# EAGLE design E32_Roco_43917_PLUX22_J1_019_01_06 (EAGLE 5.10)
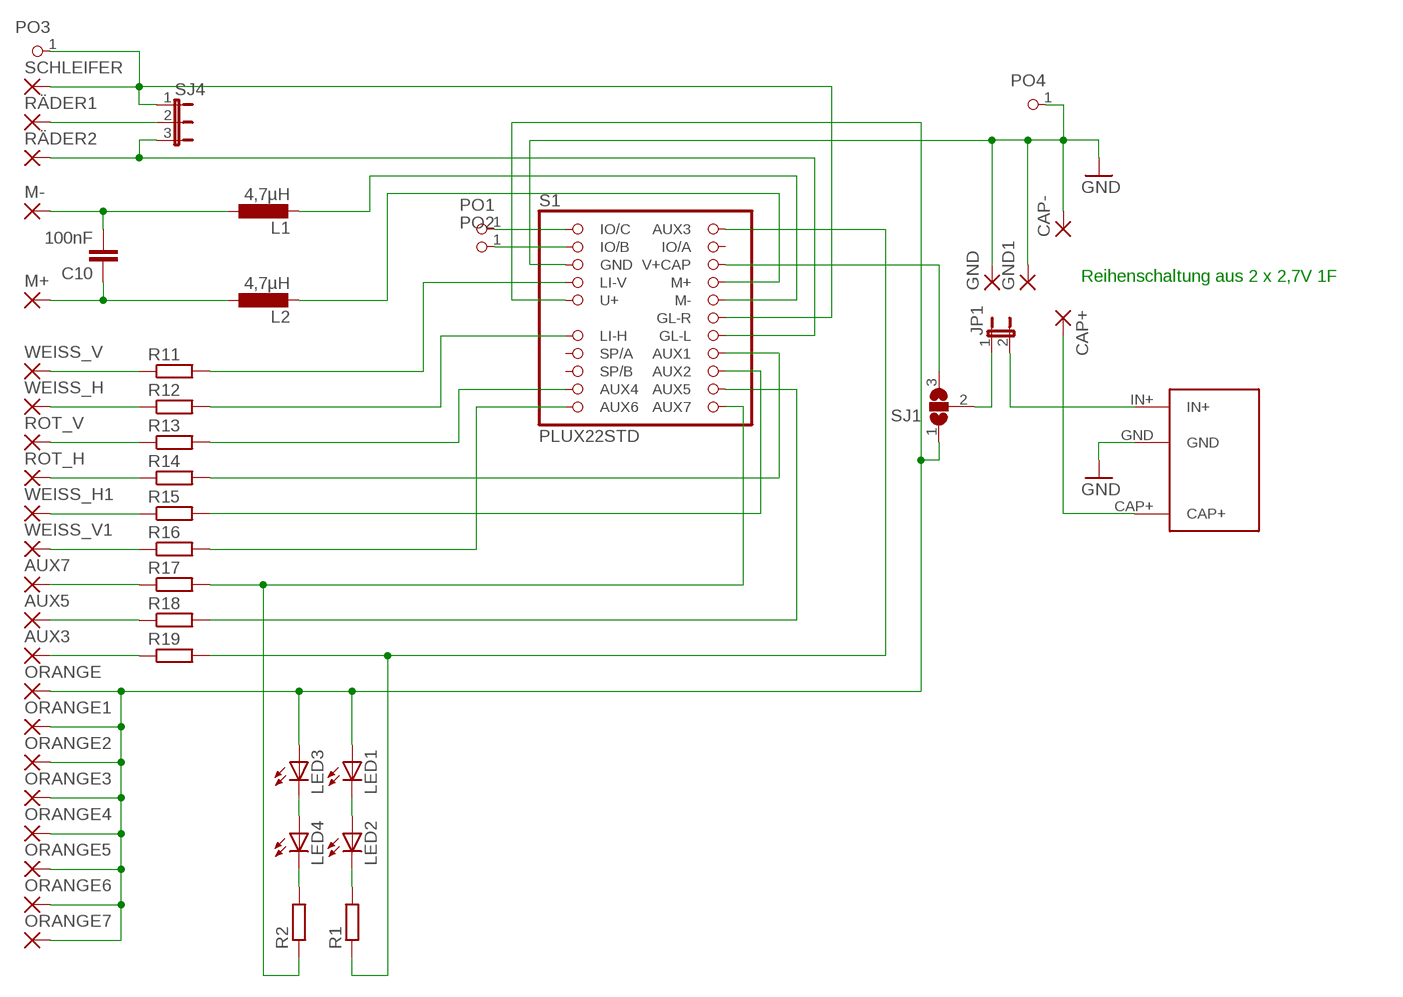
[diagram p0: schematic, sheet 1]

## Parts
AUX3  SMD2  [SMD1,27-2,54]
AUX5  SMD2  [SMD1,27-2,54]
AUX7  SMD2  [SMD1,27-2,54]
C10  100nF  C-EUC0603  [C0603]
CAP+  1,6/0,8  [1,6/0,8]
CAP-  1,6/0,8  [1,6/0,8]
GND  SMD2  [SMD1,27-2,54]
GND1  SMD2  [SMD1,27-2,54]
JP1  JP1E2,00R  [JP1_2R]
L1  4,7µH  L-EUL1212  [L1212]
L2  4,7µH  L-EUL1212  [L1212]
LED1  LEDCHIPLED_0603-JP  [CHIPLED-0603-JP]
LED2  LEDCHIPLED_0603-JP  [CHIPLED-0603-JP]
LED3  LEDCHIPLED_0603-JP  [CHIPLED-0603-JP]
LED4  LEDCHIPLED_0603-JP  [CHIPLED-0603-JP]
M+  SMD-LONG1,27-2,54  [SMD1,27-2,54]
M-  SMD-LONG1,27-2,54  [SMD1,27-2,54]
ORANGE  SMD2  [SMD1,27-2,54]
ORANGE1  SMD2  [SMD1,27-2,54]
ORANGE2  SMD2  [SMD1,27-2,54]
ORANGE3  SMD2  [SMD1,27-2,54]
ORANGE4  SMD2  [SMD1,27-2,54]
ORANGE5  SMD2  [SMD1,27-2,54]
ORANGE6  SMD2  [SMD1,27-2,54]
ORANGE7  SMD2  [SMD1,27-2,54]
PO1  POGO2,6MM  [POGO2.6]
PO2  POGO2,6MM  [POGO2.6]
PO3  POGO2,6MM  [POGO2.6]
PO4  POGO2,6MM  [POGO2.6]
R1  R-EU_R0603  [R0603]
R2  R-EU_R0603  [R0603]
R11  R-EU_R0603S  [R0603S]
R12  R-EU_R0603S  [R0603S]
R13  R-EU_R0603S  [R0603S]
R14  R-EU_R0603S  [R0603S]
R15  R-EU_R0603S  [R0603S]
R16  R-EU_R0603S  [R0603S]
R17  R-EU_R0603S  [R0603S]
R18  R-EU_R0603S  [R0603S]
R19  R-EU_R0603S  [R0603S]
ROT_H  SMD2  [SMD1,27-2,54]
ROT_V  SMD2  [SMD1,27-2,54]
RÄDER1  SMD2  [SMD1,27-2,54]
RÄDER2  SMD2  [SMD1,27-2,54]
S1  PLUX22STD  [PLUX22_SMD]
SCHLEIFER  SMD2  [SMD1,27-2,54]
SJ1  SJ2SS  [SJ_2SS]
SJ4  JP2E2R  [JP2_2R]
U$2  PWR_CAPT  [POWER_CAP]
WEISS_H  SMD2  [SMD1,27-2,54]
WEISS_H1  SMD2  [SMD1,27-2,54]
WEISS_V  SMD2  [SMD1,27-2,54]
WEISS_V1  SMD2  [SMD1,27-2,54]

## Nets
AUX1: R14.2 S1.P16(AUX1)
AUX2: R15.2 S1.P18(AUX2)
AUX4: R13.2 S1.P19(AUX4)
AUX5: R18.2 S1.P20(AUX5)
AUX6: R16.2 S1.P21(AUX6)
AUX7: R2.1 R17.2 S1.P22(AUX7)
BLAU: C10.1 L2.1 M+.1(P)
CAP: CAP+.1(P) U$2.CAP+
GELB: R12.2 S1.P13(LI-H)
GND: CAP-.1(P) GND1.1(P) GND.1(P) PO4.1 S1.P5(GND) U$2.GND
GRAU: R11.2 S1.P7(LI-V)
GRÜN: C10.2 L1.1 M-.1(P)
IN: JP1.2 U$2.IN+
IO/B: PO2.1 S1.P3(IO/B)
IO/C: PO1.1 S1.P1(IO/C)
N$1: R1.1 R19.2 S1.P2(AUX3)
N$2: LED1.C LED2.A
N$3: AUX7.1(P) R17.1
N$4: AUX5.1(P) R18.1
N$5: AUX3.1(P) R19.1
N$6: LED3.C LED4.A
N$7: JP1.1 SJ1.2
N$8: R13.1 ROT_V.1(P)
N$9: R14.1 ROT_H.1(P)
N$10: R12.1 WEISS_H.1(P)
N$11: R11.1 WEISS_V.1(P)
N$12: S1.P6(V+CAP) SJ1.3
N$13: LED2.C R1.2
N$14: LED4.C R2.2
N$20: R15.1 WEISS_H1.1(P)
N$21: R16.1 WEISS_V1.1(P)
N$22: L2.2 S1.P8(M+)
N$23: L1.2 S1.P10(M-)
ORANGE: LED1.A LED3.A ORANGE1.1(P) ORANGE2.1(P) ORANGE3.1(P) ORANGE4.1(P) ORANGE5.1(P) ORANGE6.1(P) ORANGE7.1(P) ORANGE.1(P) S1.P9(U+) SJ1.1
RÄDER: RÄDER2.1(P) S1.P14(GL-L) SJ4.3
RÄDER2: RÄDER1.1(P) SJ4.2
SCHLEIFER: PO3.1 S1.P12(GL-R) SCHLEIFER.1(P) SJ4.1
Unconnected: S1.P4(IO/A) S1.P15(SP/A) S1.P17(SP/B)

## Notes on the sheet
- Reihenschaltung aus 2 x 2,7V 1F

## Library data of the parts
AUX3 AUX5 AUX7 GND GND1 ORANGE ORANGE1-ORANGE7 ROT_H ROT_V RÄDER1 RÄDER2 SCHLEIFER WEISS_H WEISS_H1 WEISS_V WEISS_V1 = wirepad:SMD2: SMD PAD
C10 = rcl:C-EU: CAPACITOR, European symbol
CAP+ CAP- = wirepad:1,6/0,8: THROUGH-HOLE PAD
JP1 = jumper:JP1E: JUMPER
L1 L2 = rcl:L-EU: INDUCTOR, European symbol
LED1-LED4 = led:LED: LED OSRAM: - CHIPLED LG R971, LG N971, LY N971, LG Q971, LY Q971, LO R971, LY R971 LH N974, LH R974 LS Q976, LO Q976, LY Q976 LO Q996 - Hyper CHIPLED LW Q18S LB Q993, LB Q99A, LB R99A - SideLED LS A670, LO A670, LY A670, LG A670, LP A670 LB A673, LV A673, LT A673, LW A673 LH A674 LY A675 LS A676, LA A676, LO A676, LY A676, LW A676 LS A679, LY A679, LG A679 - Hyper Micro SIDELED® LS Y876, LA Y876, LO Y876, LY Y876 LT Y87S - SmartLED LW L88C, LW L88S LB L89C, LB L89S, LG L890 LS L89K, LO L89K, LY L89K LS L896, LA L896, LO L896, LY L896 - TOPLED LS T670, LO T670, LY T670, LG T670, LP T670 LSG T670, LSP T670, LSY T670, LOP T670, LYG T670 LG T671, LOG T671, LSG T671 LB T673, LV T673, LT T673, LW T673 LH T674 LS T676, LA T676, LO T676, LY T676, LB T676, LH T676, LSB T676, LW T676 LB T67C, LV T67C, LT T67C, LS T67K, LO T67K, LY T67K, LW E67C LS E67B, LA E67B, LO E67B, LY E67B, LB E67C, LV E67C, LT E67C LW T67C LS T679, LY T679, LG T679 LS T770, LO T770, LY T770, LG T770, LP T770 LB T773, LV T773, LT T773, LW T773 LH T774 LS E675, LA E675, LY E675, LS T675 LS T776, LA T776, LO T776, LY T776, LB T776 LHGB T686 LT T68C, LB T68C - Hyper Mini TOPLED® LB M676 - Mini TOPLED Santana® LG M470 LS M47K, LO M47K, LY M47K Source: http://www.osram.convergy.de LUXEON: - LUMILED® LXK2-PW12-R00, LXK2-PW12-S00, LXK2-PW14-U00, LXK2-PW14-V00 LXK2-PM12-R00, LXK2-PM12-S00, LXK2-PM14-U00 LXK2-PE12-Q00, LXK2-PE12-R00, LXK2-PE12-S00, LXK2-PE14-T00, LXK2-PE14-U00 LXK2-PB12-K00, LXK2-PB12-L00, LXK2-PB12-M00, LXK2-PB14-N00, LXK2-PB14-P00, LXK2-PB14-Q00 LXK2-PR12-L00, LXK2-PR12-M00, LXK2-PR14-Q00, LXK2-PR14-R00 LXK2-PD12-Q00, LXK2-PD12-R00, LXK2-PD12-S00 LXK2-PH12-R00, LXK2-PH12-S00 LXK2-PL12-P00, LXK2-PL12-Q00, LXK2-PL12-R00 Source: www.luxeon.com KINGBRIGHT: KA-3528ASYC Source: www.kingbright.com
M+ M- = wirepad:SMD-LONG
PO1-PO4 = pinhead:POGO
R1 R2 R11-R19 = rcl:R-EU_: RESISTOR, European symbol
S1 = pinhead:PLUX22
SJ1 = jumper:SJ2
SJ4 = jumper:JP2E: JUMPER
U$2 = pinhead:PWR_CAP

## Board
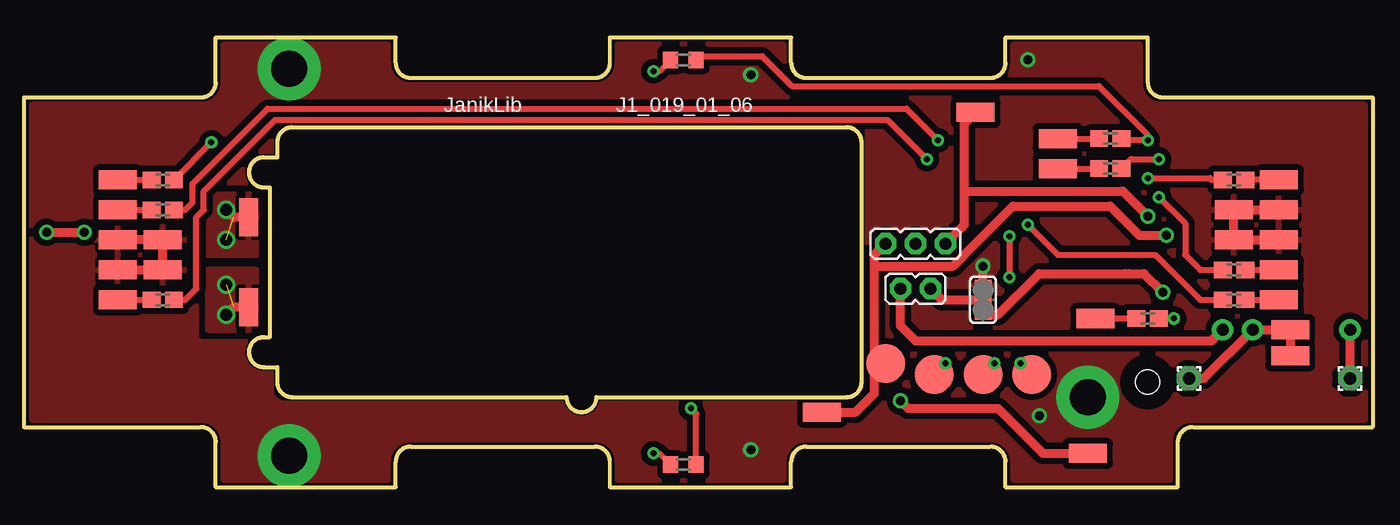
[diagram p1: board, top side]
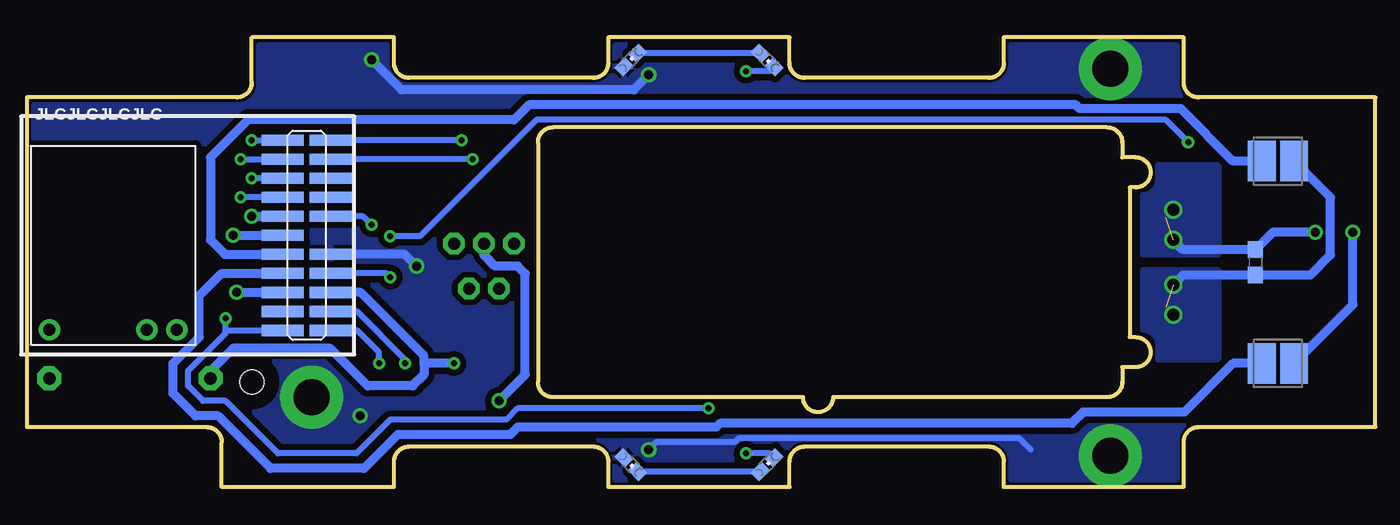
[diagram p2: board, bottom side, seen from below]

No outline drawn. Coordinates in mm, seen from the top.
Copper layers (1*16): Top 0.035mm / dielectric 1.5mm / Bottom 0.035mm
Design rules "default *": minimum track width 10mil, minimum drill 0.4mm, track to track 8mil, track to pad 8mil, pad to pad 8mil, via to via 8mil, smd to smd 8mil, copper to edge 40mil, drill to drill 8mil, minimum pad ring 10mil, minimum via ring 8mil, stop-mask expansion 4mil, vias tented up to drill 0mil, thermal gap 10mil
Holes 1.6 mm at 75,7
tRestrict: area 15.5,5.5 to 55.4,23.5
bRestrict: area 15.5,5.5 to 55.4,23.5; area 78.8,9.5 to 89.8,22.8
Milling: 65 lines

### Footprints (pad centres in the part's own frame; a part is rotated, then mirrored left to right if it is on the bottom)
SMD1,27-2,54 = smd 1.27 x 2.54: 1 0,0
C0603 = smd 1.1 x 1: 1 -0.85,0; 2 0.85,0
1,6/0,8 = drill 0.813 pad 1.6 octagon: 1 0,0
JP1_2R = drill 0.8 pad 1.422 octagon: 1 0,-1; 2 0,1
L1212 = smd 1.85 x 2.7: 1 -1.075,0; 2 1.075,0
CHIPLED-0603-JP = smd 0.8 x 1: A 0,-0.65; C 0,0.65
POGO2.6 = smd 2.6 x 2.6: 1 0,0
R0603 = smd 1 x 1.1: 1 -0.85,0; 2 0.85,0
R0603S = smd 1.2 x 1.1: 1 -0.75,0; 2 0.75,0
PLUX22_SMD = smd 0.75 x 2.8: P1 -6.35,-0.953; P2 -6.35,2.223; P3 -5.08,-0.953; P4 -5.08,2.223; P5 -3.81,-0.953; P6 -3.81,2.223; P7 -2.54,-0.953; P8 -2.54,2.223; P9 -1.27,-0.953; P10 -1.27,2.223; P12 0,2.223; P13 1.27,-0.953; P14 1.27,2.223; P15 2.54,-0.953; P16 2.54,2.223; P17 3.81,-0.953; P18 3.81,2.223; P19 5.08,-0.953; P20 5.08,2.223; P21 6.35,-0.953; P22 6.35,2.223
SJ_2SS = smd 0.7 x 1.1: 1 -1,0; 2 0,0; 3 1,0
JP2_2R = drill 0.8 pad 1.422 octagon: 1 0,-2; 2 0,0; 3 0,2
POWER_CAP = drill 0.8 pad 1.422 round: CAP+ 0,-6.5; GND 0,0; IN+ 0,2

### Placement (x,y rotation side)
AUX3  71.5,11.25 90 top
AUX5  69,21.25 90 top
AUX7  69,23.25 90 top
C10  8,15 270 bottom
CAP+  88.5,7.25 0 top
CAP-  77.75,7.25 0 top
GND  84.5,10.5 90 top
GND1  84.5,8.75 90 top
JP1  59.5,13.25 90 top
L1  6.5,21.75 180 bottom
L2  6.5,8.25 180 bottom
LED1  49.7,1.5 225 bottom
LED2  40.6,1.5 315 bottom
LED3  49.7,28.5 315 bottom
LED4  40.6,28.5 225 bottom
M+  15,18 0 top
M-  15,12 0 top
ORANGE  6.25,16.5 270 top
ORANGE1  9.25,16.5 270 top
ORANGE2  83.75,18.5 270 top
ORANGE3  80.75,18.5 270 top
ORANGE4  6.25,14.5 90 top
ORANGE5  9.25,14.5 90 top
ORANGE6  80.75,16.5 90 top
ORANGE7  83.75,16.5 90 top
PO1  67.25,7.5 0 top
PO2  64,7.5 0 top
PO3  57.5,8.25 0 top
PO4  60.75,7.5 0 top
R1  44,1.5 180 top
R2  44,28.5 180 top
R11  9.25,20.5 0 top
R12  80.75,12.5 180 top
R13  9.25,12.5 0 top
R14  80.75,14.5 180 top
R15  80.75,20.5 180 top
R16  9.25,18.5 0 top
R17  72.5,23.25 0 top
R18  72.5,21.25 0 top
R19  75,11.25 0 top
ROT_H  83.75,14.5 90 top
ROT_V  6.25,12.5 90 top
RÄDER1  71,2.25 90 top
RÄDER2  63.5,25 90 top
S1  70.7,16.8 90 bottom
SCHLEIFER  53.25,5 270 top
SJ1  64,12.5 270 top
SJ4  59.5,16.25 270 top
U$2  82,10.5 270 bottom
WEISS_H  83.75,12.5 270 top
WEISS_H1  83.75,20.5 90 top
WEISS_V  6.25,20.5 270 top
WEISS_V1  6.25,18.5 90 top

### Tracks (layer width: path | path; a pad name or v marks a point on that pad's centre or on a via)
AUX1  (via drill 0.4)
  Top 0.406: R14.2 78.5,14.5 77.5,15.5 77.5,17.59 v75.75,19.34
  Bottom 0.406: S1.P16 v75.75,19.34
AUX2  (via drill 0.4)
  Top 0.406: v75,20.61 79.14,20.61 79.25,20.5 R15.2
  Bottom 0.406: S1.P18 v75,20.61
AUX4  (via drill 0.4)
  Top 0.406: v60.25,21.88 57.63,24.5 16.75,24.5 12,19.75 12,18.5 11.5,18 11.5,13.25 10.75,12.5 R13.2
  Bottom 0.406: v60.25,21.88 S1.P19
AUX5  (via drill 0.4)
  Top 0.406: v75.75,21.88 73.88,21.88 R18.2
  Bottom 0.406: v75.75,21.88 S1.P20
AUX6  (via drill 0.4)
  Top 0.406: v61,23.15 58.9,25.25 16.25,25.25 11.25,20.25 11.25,19 10.75,18.5 R16.2
  Bottom 0.406: v61,23.15 S1.P21
AUX7  (via drill 0.4)
  Top 0.406: R17.2 73.35,23.15 v75,23.15 75,23.5 71.75,26.75 51.25,26.75 49.25,28.75 45.1,28.75 R2.1
  Bottom 0.406: v75,23.15 S1.P22
BLAU  (via drill 0.6, 0.8)  (1 unrouted)
  Top 0.61: M+.1 14,18 v13.5,18.5 | v1.5,17 v4,17
  Bottom 0.61: v13.5,16.5 12.85,15.85 C10.1 6.85,17 v4,17 | L2.1 1.5,12.18 v1.5,17
  pour Bottom (isolate 0.406): 15.5,15.5 15.5,19.5 arc-90 14.5,20.5 14.5,21.5 10.5,21.5 10.5,15.5
  pour Top (isolate 0.406): 15.5,15.5 15.5,19.5 12.25,19.5 12.25,15.5
CAP
  Top 0.61: CAP+.1 U$2.CAP+
GELB  (via drill 0.4)
  Top 0.406: R12.2 78.5,12.5 75.5,15.5 69,15.5 v67,17.5
  Bottom 0.406: S1.P13 67.57,18.07 v67,17.5
GND  (via drill 0.4)
  Top 0.61: GND1.1 GND.1 U$2.GND 78.75,7.25 CAP-.1 | PO4.1 v61.5,8.25
  Bottom 0.61: S1.P5 67.74,12.99 63.5,8.75 63.5,8.25 | 63.5,8.25 63.5,7.5 64.25,6.75 67.25,6.75 69.75,9.25 76.25,9.25 77.75,7.75 CAP-.1 | v61.5,8.25 63.5,8.25
GRAU  (via drill 0.4)
  Top 0.406: R11.2 v12.5,23 | v65.75,16.75 v65.75,14
  Bottom 0.406: v12.5,23 14,24.5 56,24.5 63.75,16.75 v65.75,16.75 | S1.P7 66.01,14.26 v65.75,14
GRÜN  (via drill 0.8)  (1 unrouted)
  Top 0.61: M-.1 14,12 v13.5,11.5
  Bottom 0.61: v13.5,13.5 12.85,14.15 C10.2 4.35,14.15 3,15.5 3,19.32 L1.1
  pour Bottom (isolate 0.406): 10.5,8.5 14.5,8.5 14.5,9.5 arc-90 15.5,10.5 15.5,14.5 10.5,14.5
  pour Top (isolate 0.406): 12.25,10.5 15.5,10.5 15.5,14.5 12.25,14.5
IN
  Top 0.61: JP1.2 58.5,10.75 59.5,9.75 79.25,9.75 U$2.IN+
IO/B  (via drill 0.4)
  Top 0.406: PO2.1 v64.75,8.25
  Bottom 0.406: S1.P3 67.97,11.72 64.75,8.5 v64.75,8.25
IO/C  (via drill 0.4)
  Top 0.406: PO1.1 v66.5,8.25
  Bottom 0.406: S1.P1 67.95,10.45 66.5,9 v66.5,8.25
N$1  (via drill 0.4)
  Top 0.406: v76.75,11.25 R19.2 | R1.1 44.85,4.9 v44.5,5.25
  Bottom 0.406: 76.75,10.45 76.75,10.25 79.25,7.75 79.25,6.75 78.25,5.75 76.75,5.75 73.25,2.25 68,2.25 65.75,4.5 58,4.5 57.25,5.25 v44.5,5.25 | 76.75,10.45 S1.P2 | 76.75,10.45 v76.75,11.25
N$2
  Bottom 0.406: LED2.A LED1.C
N$3
  Top 0.406: AUX7.1 R17.1
N$4
  Top 0.406: AUX5.1 R18.1
N$5
  Top 0.406: AUX3.1 R19.1
N$6
  Bottom 0.406: LED4.A LED3.C
N$7
  Top 0.61: SJ1.2 61.25,12.5 JP1.1
N$8
  Top 0.406: ROT_V.1 R13.1
N$9
  Top 0.406: R14.1 ROT_H.1
N$10
  Top 0.406: R12.1 WEISS_H.1
N$11
  Top 0.406: WEISS_V.1 R11.1
N$12  (via drill 0.6)
  Top 0.61: SJ1.3 65,11.5 67.75,14.25 73.5,14.25 73.75,14.25 74.74,14.25 v76,12.99
  Bottom 0.61: v76,12.99 S1.P6
N$13  (via drill 0.4)
  Top 0.406: v42,2.25 42.4,2.25 R1.2
  Bottom 0.406: LED2.C 40.43,2.25 v42,2.25
N$14  (via drill 0.4)
  Top 0.406: v42,27.75 42.4,27.75 R2.2
  Bottom 0.406: LED4.C 40.43,27.75 v42,27.75
N$20
  Top 0.406: WEISS_H1.1 R15.1
N$21
  Top 0.406: WEISS_V1.1 R16.1
N$22
  Bottom 0.61: S1.P8 77,14.26 78.5,12.76 78.5,10 80.25,8.25 80.25,6.25 78.75,4.75 77.25,4.75 73.75,1.25 67.5,1.25 65.25,3.5 57.75,3.5 57.25,4 44,4 43.75,4.25 20.25,4.25 19.5,5 12.75,5 9.5,8.25 L2.2
N$23
  Bottom 0.61: S1.P10 76.78,15.53 77.75,16.5 77.75,22 75.25,24.5 57.5,24.5 56.5,25.5 20,25.5 19.75,25.25 13,25.25 9.5,21.75 L1.2
ORANGE  (via drill 0.6, 2.4 pad 4.2)
  Top 0.61: ORANGE.1 ORANGE1.1 ORANGE5.1 ORANGE4.1 | ORANGE2.1 ORANGE3.1 ORANGE6.1 ORANGE7.1 | SJ1.1 v64,14.75
  Bottom 0.406: v48.5,2.5 48,3 42.75,3 42.5,3.25 23.75,3.25 23,2.5
  Bottom 0.61: 68.22,15.53 64.78,15.53 v64,14.75 | v48.5,27.5 49.5,26.5 65,26.5 v67,28.5
  other vias: 71,6 17.7,2.1 17.7,27.9 67.75,4.75
  pour Bottom (isolate 0.406, rank 2): 0.5,25.5 0.5,4.5 11.8,4.5 arc-90 13.3,3 13.3,0.5 24.3,0.5 24.3,1.7 arc-90 25.8,3.2 38.1,3.2 arc-90 39.6,1.7 39.6,0.5 50.7,0.5 50.7,1.7 arc-90 52.2,3.2 64.5,3.2 arc-90 66,1.7 66,0.5 76.5,0.5 76.5,3.2 arc-90 78,4.5 89.5,4.5 89.5,25.5 76,25.5 arc-90 74.5,26.8 74.5,29.5 66,29.5 66,28.3 arc-90 64.5,26.8 52.2,26.8 arc-90 50.7,28.3 50.7,29.5 39.6,29.5 39.6,28.3 arc-90 38.1,26.8 25.8,26.8 arc-90 24.3,28.3 24.3,29.5 13.3,29.5 13.3,27 arc-90 11.8,25.5
  pour Top (isolate 0.406, rank 2): 0.5,25.5 0.5,4.5 11.8,4.5 arc-90 13.3,3 13.3,0.5 24.3,0.5 24.3,1.7 arc-90 25.8,3.2 38.1,3.2 arc-90 39.6,1.7 39.6,0.5 50.7,0.5 50.7,1.7 arc-90 52.2,3.2 64.5,3.2 arc-90 66,1.7 66,0.5 76.5,0.5 76.5,3.2 arc-90 78,4.5 89.5,4.5 89.5,25.5 76,25.5 arc-90 74.5,26.8 74.5,29.5 66,29.5 66,28.3 arc-90 64.5,26.8 52.2,26.8 arc-90 50.7,28.3 50.7,29.5 39.6,29.5 39.6,28.3 arc-90 38.1,26.8 25.8,26.8 arc-90 24.3,28.3 24.3,29.5 13.3,29.5 13.3,27 arc-90 11.8,25.5
RÄDER  (via drill 0.6)
  Top 0.61: RÄDER2.1 62.75,24.25 62.75,19.75 | 62.75,19.75 73.32,19.75 v75,18.07 | 62.75,19.75 62.75,17.5 SJ4.3
  Bottom 0.61: v75,18.07 S1.P14
RÄDER2  (via drill 0.6)
  Top 0.61: RÄDER1.1 68,2.25 65,5.25 59,5.25 v58.5,5.75
  Bottom 0.61: SJ4.2 59.5,15.5 58.75,14.75 57.25,14.75 56.75,14.25 56.75,7.5 v58.5,5.75
SCHLEIFER  (via drill 0.6)
  Top 0.61: SCHLEIFER.1 55.5,5 56.75,6.25 56.75,8.25 | v76.25,16.8 74.45,16.8 72.5,18.75 66,18.75 62,14.75 56.75,14.75 | 56.75,14.75 56.75,15.5 SJ4.1 | 56.75,8.25 PO3.1 | 56.75,8.25 56.75,14.75
  Bottom 0.61: v76.25,16.8 S1.P12

### Text on the board
tNames: JanikLib | J1_019_01_06
bNames: JLCJLCJLCJLC
tStop: Rad_R | AUX7 | AUX5 | we_v | AUX2 | AUX6 | DC | AC | + | + | AUX1 | AUX4 | AUX3 | we_h | CAP | Roco 43917 | GND | E32 PLUX22 | CAP+ | GND | design by Janik Merz | Schleifer | Rad_L